# EAGLE schematic 32u4.Simple.Breakout (EAGLE 7.4.0)
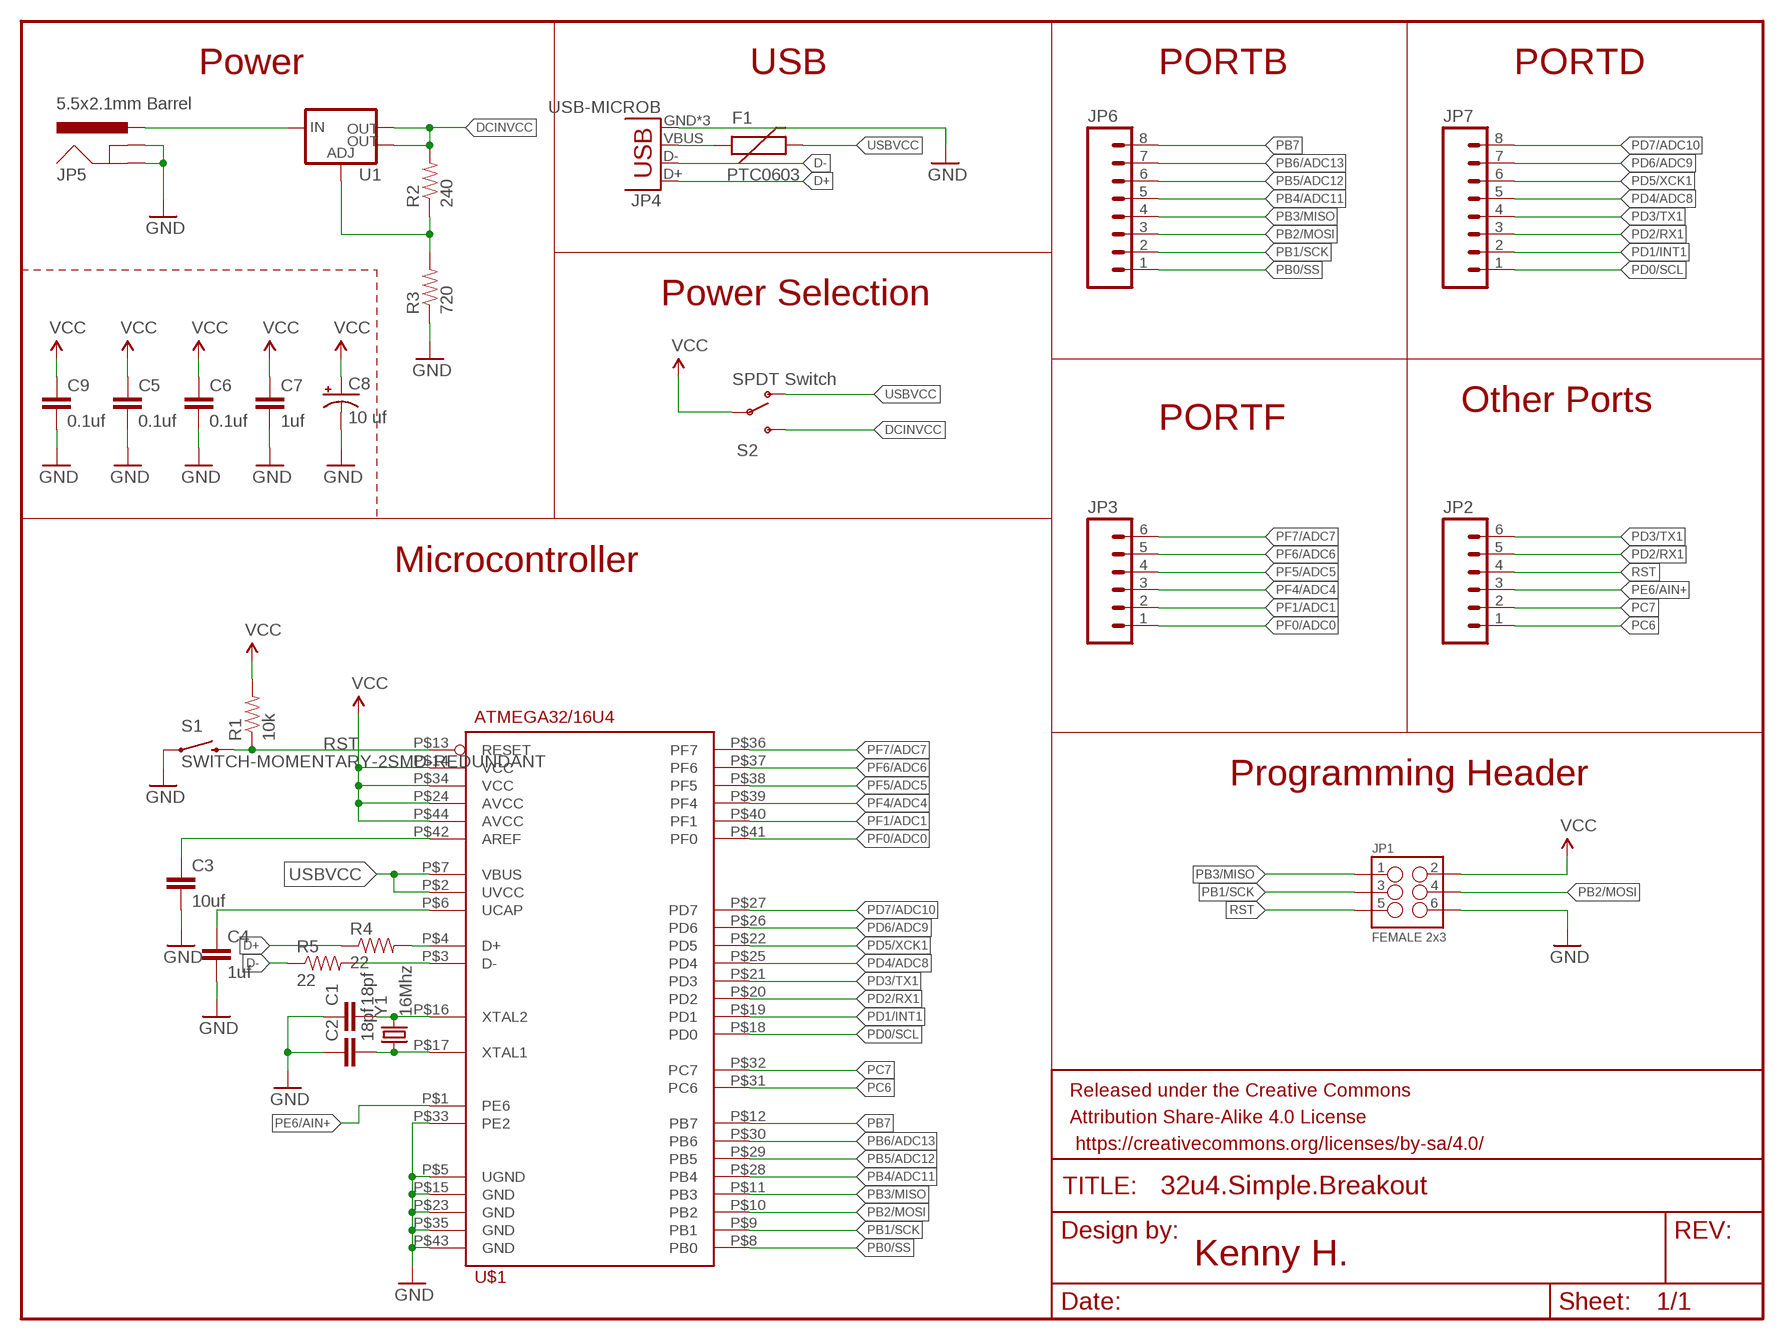
[diagram p0: schematic, sheet 1]

## Parts
C1  18pf  CAP0603-CAP  [0603-CAP]
C2  18pf  CAP0603-CAP  [0603-CAP]
C3  10uf  CAP0603-CAP  [0603-CAP]
C4  1uf  CAP0603-CAP  [0603-CAP]
C5  0.1uf  CAP0603-CAP  [0603-CAP]
C6  0.1uf  CAP0603-CAP  [0603-CAP]
C7  1uf  CAP0603-CAP  [0603-CAP]
C8  10 uf  CAP_POLPTH2  [CPOL-RADIAL-10UF-25V]
C9  0.1uf  CAP0603-CAP  [0603-CAP]
F1  PTC0603  [0603]
FRAME1  FRAME-LETTER  [CREATIVE_COMMONS]
JP1  FEMALE 2x3  M03X2FEMALE  [2X3]
JP2  M06FEMALE_LOCK  [1X06_FEMALE_LOCK.010]
JP3  M06FEMALE_LOCK  [1X06_FEMALE_LOCK.010]
JP4  USB-MICROB  [USB-MICROB]
JP5  5.5x2.1mm Barrel  POWER_JACKSMD  [POWER_JACK_SMD]
JP6  M08FEMALE_LOCK  [1X08_FEMALE_LOCK]
JP7  M08FEMALE_LOCK  [1X08_FEMALE_LOCK]
R1  10k  RESISTOR0603-RES  [0603-RES]
R2  240  RESISTOR0603-RES  [0603-RES]
R3  720  RESISTOR0603-RES  [0603-RES]
R4  22  RESISTOR0603-RES  [0603-RES]
R5  22  RESISTOR0603-RES  [0603-RES]
S1  SWITCH-MOMENTARY-2SMD-REDUNDANT  [TACTILE-SWITCH-SMD]
S2  SPDT Switch  SWITCH-SPDT-SMD-A  [SWITCH-SPST-SMD-A]
U1  V_REG_LM1117SOT223  [SOT223]
U$1  ATMEGA32/16U4  [TQFP_44_0.8MM]
Y1  16Mhz  CRYSTAL5X3  [CRYSTAL-SMD-5X3]

## Nets
D+: JP4.D+ R4.1
D-: JP4.D- R5.1
DCINVCC: R2.2 S2.3(S) U1.2(OUT) U1.4(OUT)
GND: C1.1 C2.1 C3.2 C4.2 C5.2 C6.2 C7.2 C8.2(-) C9.2 JP1.6 JP4.GND JP4.MT1(GND) JP4.MT2(GND) JP5.GND(GNDBREAK) JP5.P$4(GND) R3.1 S1.1 S1.2 U$1.P$5(UGND) U$1.P$15(GND) U$1.P$23(GND) U$1.P$33(PE2) U$1.P$35(GND) U$1.P$43(GND)
N$1: C3.1 U$1.P$42(AREF)
N$2: C4.1 U$1.P$6(UCAP)
N$3: R2.1 R3.2 U1.1(ADJ)
N$4: JP5.VIN0(PWR) U1.3(IN)
N$5: R4.2 U$1.P$4(D+)
N$6: R5.2 U$1.P$3(D-)
N$7: F1.1 JP4.VBUS
PB0/SS: JP6.1 U$1.P$8(PB0)
PB1/SCK: JP1.3 JP6.2 U$1.P$9(PB1)
PB2/MOSI: JP1.4 JP6.3 U$1.P$10(PB2)
PB3/MISO: JP1.1 JP6.4 U$1.P$11(PB3)
PB4/ADC11: JP6.5 U$1.P$28(PB4)
PB5/ADC12: JP6.6 U$1.P$29(PB5)
PB6/ADC13: JP6.7 U$1.P$30(PB6)
PB7: JP6.8 U$1.P$12(PB7)
PC6: JP2.1 U$1.P$31(PC6)
PC7: JP2.2 U$1.P$32(PC7)
PD0/SCL: JP7.1 U$1.P$18(PD0)
PD1/INT1: JP7.2 U$1.P$19(PD1)
PD2/RX1: JP2.5 JP7.3 U$1.P$20(PD2)
PD3/TX1: JP2.6 JP7.4 U$1.P$21(PD3)
PD4/ADC8: JP7.5 U$1.P$25(PD4)
PD5/XCK1: JP7.6 U$1.P$22(PD5)
PD6/ADC9: JP7.7 U$1.P$26(PD6)
PD7/ADC10: JP7.8 U$1.P$27(PD7)
PE6/AIN+: JP2.3 U$1.P$1(PE6)
PF0/ADC0: JP3.1 U$1.P$41(PF0)
PF1/ADC1: JP3.2 U$1.P$40(PF1)
PF4/ADC4: JP3.3 U$1.P$39(PF4)
PF5/ADC5: JP3.4 U$1.P$38(PF5)
PF6/ADC6: JP3.5 U$1.P$37(PF6)
PF7/ADC7: JP3.6 U$1.P$36(PF7)
RST: JP1.5 JP2.4 R1.1 S1.3 S1.4 U$1.P$13(RESET)
USBVCC: F1.2 S2.1(O) U$1.P$2(UVCC) U$1.P$7(VBUS)
VCC: C5.1 C6.1 C7.1 C8.1(+) C9.1 JP1.2 R1.2 S2.2(P) U$1.P$14(VCC) U$1.P$24(AVCC) U$1.P$34(VCC) U$1.P$44(AVCC)
XTAL1: C2.2 U$1.P$17(XTAL1) Y1.1
XTAL2: C1.2 U$1.P$16(XTAL2) Y1.3

## Notes on the sheet
- Power | USB | PORTB | PORTD
- Power Selection
- Other Ports
- PORTF
- Microcontroller
- Programming Header
- Kenny H.

## Library data of the parts
C1-C7 C9 = SparkFun-Capacitors:CAP: Capacitor Standard 0603 ceramic capacitor, and 0.1" leaded capacitor.
C8 = SparkFun-Capacitors:CAP_POL: Capacitor Polarized These are standard SMD and PTH capacitors. Normally 10uF, 47uF, and 100uF in electrolytic and tantalum varieties. Always verify the external diameter of the through hole cap, it varies with capacity, voltage, and manufacturer. The EIA devices should be standard.
F1 = SparkFun-PowerIC:PTC: Resettable Fuse PTC Resettable Fuse. Spark Fun Electronics SKU : COM-08357
FRAME1 = SparkFun-Aesthetics:FRAME-LETTER: Schematic Frame Standard 8.5x11 US Letter frame
JP1 = SparkFun-Connectors:M03X2: 2x3 .1" header. Shrouded, with keying- CONN-10681 SMT- CONN-11415 Pogo pins- HW-11044; PROD_ID: CONN-11566
JP2 JP3 = SparkFun-Connectors:M06: Header 6 Standard 6-pin 0.1" header. Use with straight break away headers (SKU : PRT-00116), right angle break away headers (PRT-00553), swiss pins (PRT-00743), machine pins (PRT-00117), and female headers (PRT-00115). Molex polarized connector foot print use with SKU : PRT-08094 with associated crimp pins and housings. NOTES ON THE VARIANTS LOCK and LOCK_LONGPADS... This footprint was designed to help hold the alignment of a through-hole component (i.e. 6-pin header) while soldering it into place. You may notice that each hole has been shifted either up or down by 0.005 of an inch from it's more standard position (which is a perfectly straight line). This slight alteration caused the pins (the squares in the middle) to touch the edges of the holes. Because they are alternating, it causes a "brace" to hold the component in place. 0.005 has proven to be the perfect amount of "off-center" position when using our standard breakaway headers. Although looks a little odd when you look at the bare footprint, once you have a header in there, the alteration is very hard to notice. Also,if you push a header all the way into place, it is covered up entirely on the bottom side. This idea of altering the position of holes to aid alignment will be further integrated into the Sparkfun Library for other footprints. It can help hold any component with 3 or more connection pins.
JP4 = SparkFun-Connectors:USB: USB Connectors USB-B-PTH is fully proven SKU : PRT-00139/CONN-08278 USB-miniB is fully proven SKU : PRT-00587 USB-A-PCB is untested. USB-A-H is throughly reviewed, but untested. Spark Fun Electronics SKU : PRT-00437 USB-B-SMT is throughly reviewed, but untested. Needs silkscreen touching up. USB-A-S has not been used/tested USB-MB-H has not been used/tested USB-MICROB has been used. CONN-09505; PROD_ID: CONN-09505
JP5 = SparkFun-Connectors:POWER_JACK: Power Jack This is the standard 5.5mm barrel jack for power. The PTH is the most common, proven, reliable, footprint. The Slot footprint only works if the mill layer is transmitted to the PCB fab house so be warned. Mating wall wart : TOL-00298 (and others); PROD_ID: CONN-08106; SF_ID: PRT-12748
JP6 JP7 = SparkFun-Connectors:M08: Header 8 Standard 8-pin 0.1" header. Use with straight break away headers (SKU : PRT-00116), right angle break away headers (PRT-00553), swiss pins (PRT-00743), machine pins (PRT-00117), and female headers (PRT-00115).
R1-R3 = SparkFun-Passives:RESISTOR: Resistor Basic schematic elements and footprints for 0603, 1206, and PTH resistors.
R4 R5 = SparkFun-Resistors:RESISTOR: Resistor Basic schematic elements and footprints for 0603, 1206, and PTH resistors.
S1 = SparkFun-Electromechanical:SWITCH-MOMENTARY-2: Various NO switches- pushbuttons, reed, etc; PROD_ID: SWCH-08247
S2 = SparkFun-Electromechanical:SWITCH-SPDT: SPDT Switch Simple slide switch, Spark Fun Electronics SKU : COM-00102 DPDT SMT slide switch, AYZ0202, SWCH-08179
U1 = SparkFun-PowerIC:V_REG_LM1117: Voltage Regulator LM1117 Standard adjustable voltage regulator but in SMD form. Spark Fun Electronics SKU : COM-00595; PROD_ID: VREG-08170
U$1 = Kenny:ATMEGA32/16U4: ATmega32u4 and 16u4 Atmel's ATmega32u4 and 16u4 -This is Atmel's 32u4 in a TQFP44 package. -Made by Kenny H. -Created for a 32u4 breakout 8-bit microcontroller with 16/32K bytes of ISP flash and USB Controller
Y1 = SparkFun-FreqCtrl:CRYSTAL: Various standard crystals. Proven footprints.; PROD_ID: XTAL-08218